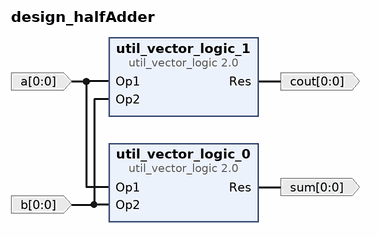
[diagram p0: block diagram of the top level]
# Vivado block design design_halfAdder, xc7a100tcsg324-1, Vivado 2020.2
create_bd_design design_halfAdder

create_bd_port -dir I -from 0 -to 0 a
create_bd_port -dir I -from 0 -to 0 b
create_bd_port -dir O -from 0 -to 0 cout
create_bd_port -dir O -from 0 -to 0 sum

create_bd_cell -type ip -vlnv xilinx.com:ip:util_vector_logic:2.0 util_vector_logic_1
set_property -dict {CONFIG.C_SIZE 1} [get_bd_cells util_vector_logic_1]
create_bd_cell -type ip -vlnv xilinx.com:ip:util_vector_logic:2.0 util_vector_logic_0
set_property -dict {CONFIG.C_OPERATION xor CONFIG.C_SIZE 1} [get_bd_cells util_vector_logic_0]

# ---- connections ----

connect_bd_net -net Op1_0_1 [get_bd_ports a] [get_bd_pins util_vector_logic_1/Op1] [get_bd_pins util_vector_logic_0/Op1]
connect_bd_net -net Op2_0_1 [get_bd_ports b] [get_bd_pins util_vector_logic_1/Op2] [get_bd_pins util_vector_logic_0/Op2]
connect_bd_net [get_bd_pins util_vector_logic_1/Res] [get_bd_ports cout]
connect_bd_net [get_bd_pins util_vector_logic_0/Res] [get_bd_ports sum]

validate_bd_design
save_bd_design
